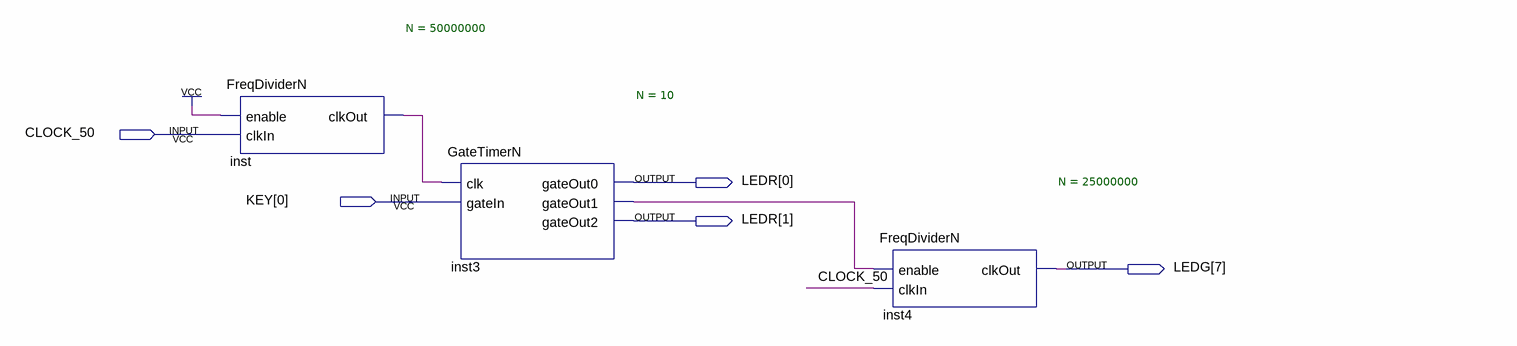
[diagram p0: schematic sheet]
// Quartus schematic ParkGate_Demo.bdf as structural Verilog: 3 symbols, 5 pins
module ParkGate_Demo (
  input  CLOCK_50,
  input  [0:0] KEY,
  output [1:0] LEDR,
  output [7:7] LEDG
);

  wire inst3_gateout1, inst_clkout;

  FreqDividerN #(.N(50000000)) inst (.enable(1'b1), .clkIn(CLOCK_50), .clkOut(inst_clkout));
  GateTimerN #(.N(10)) inst3 (
    .clk(inst_clkout), .gateIn(KEY[0]), .gateOut0(LEDR[0]), .gateOut1(inst3_gateout1), .gateOut2(LEDR[1]));
  FreqDividerN #(.N(25000000)) inst4 (.enable(inst3_gateout1), .clkIn(CLOCK_50), .clkOut(LEDG[7]));
endmodule
